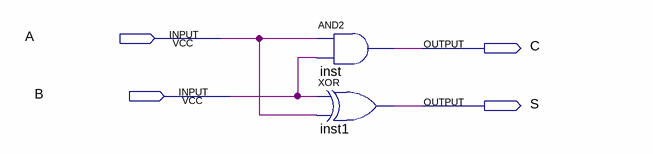
[diagram p0: schematic sheet]
// Quartus schematic halfadder_x.bdf as structural Verilog: 2 symbols, 4 pins
module halfadder_x (
  input  A,
  input  B,
  output C,
  output S
);

  and inst (C, A, B);
  xor inst1 (S, B, A);
endmodule
